# EAGLE design Voltmeter (EAGLE 9.5.2)

## Sheet 1 of 3: Fuente
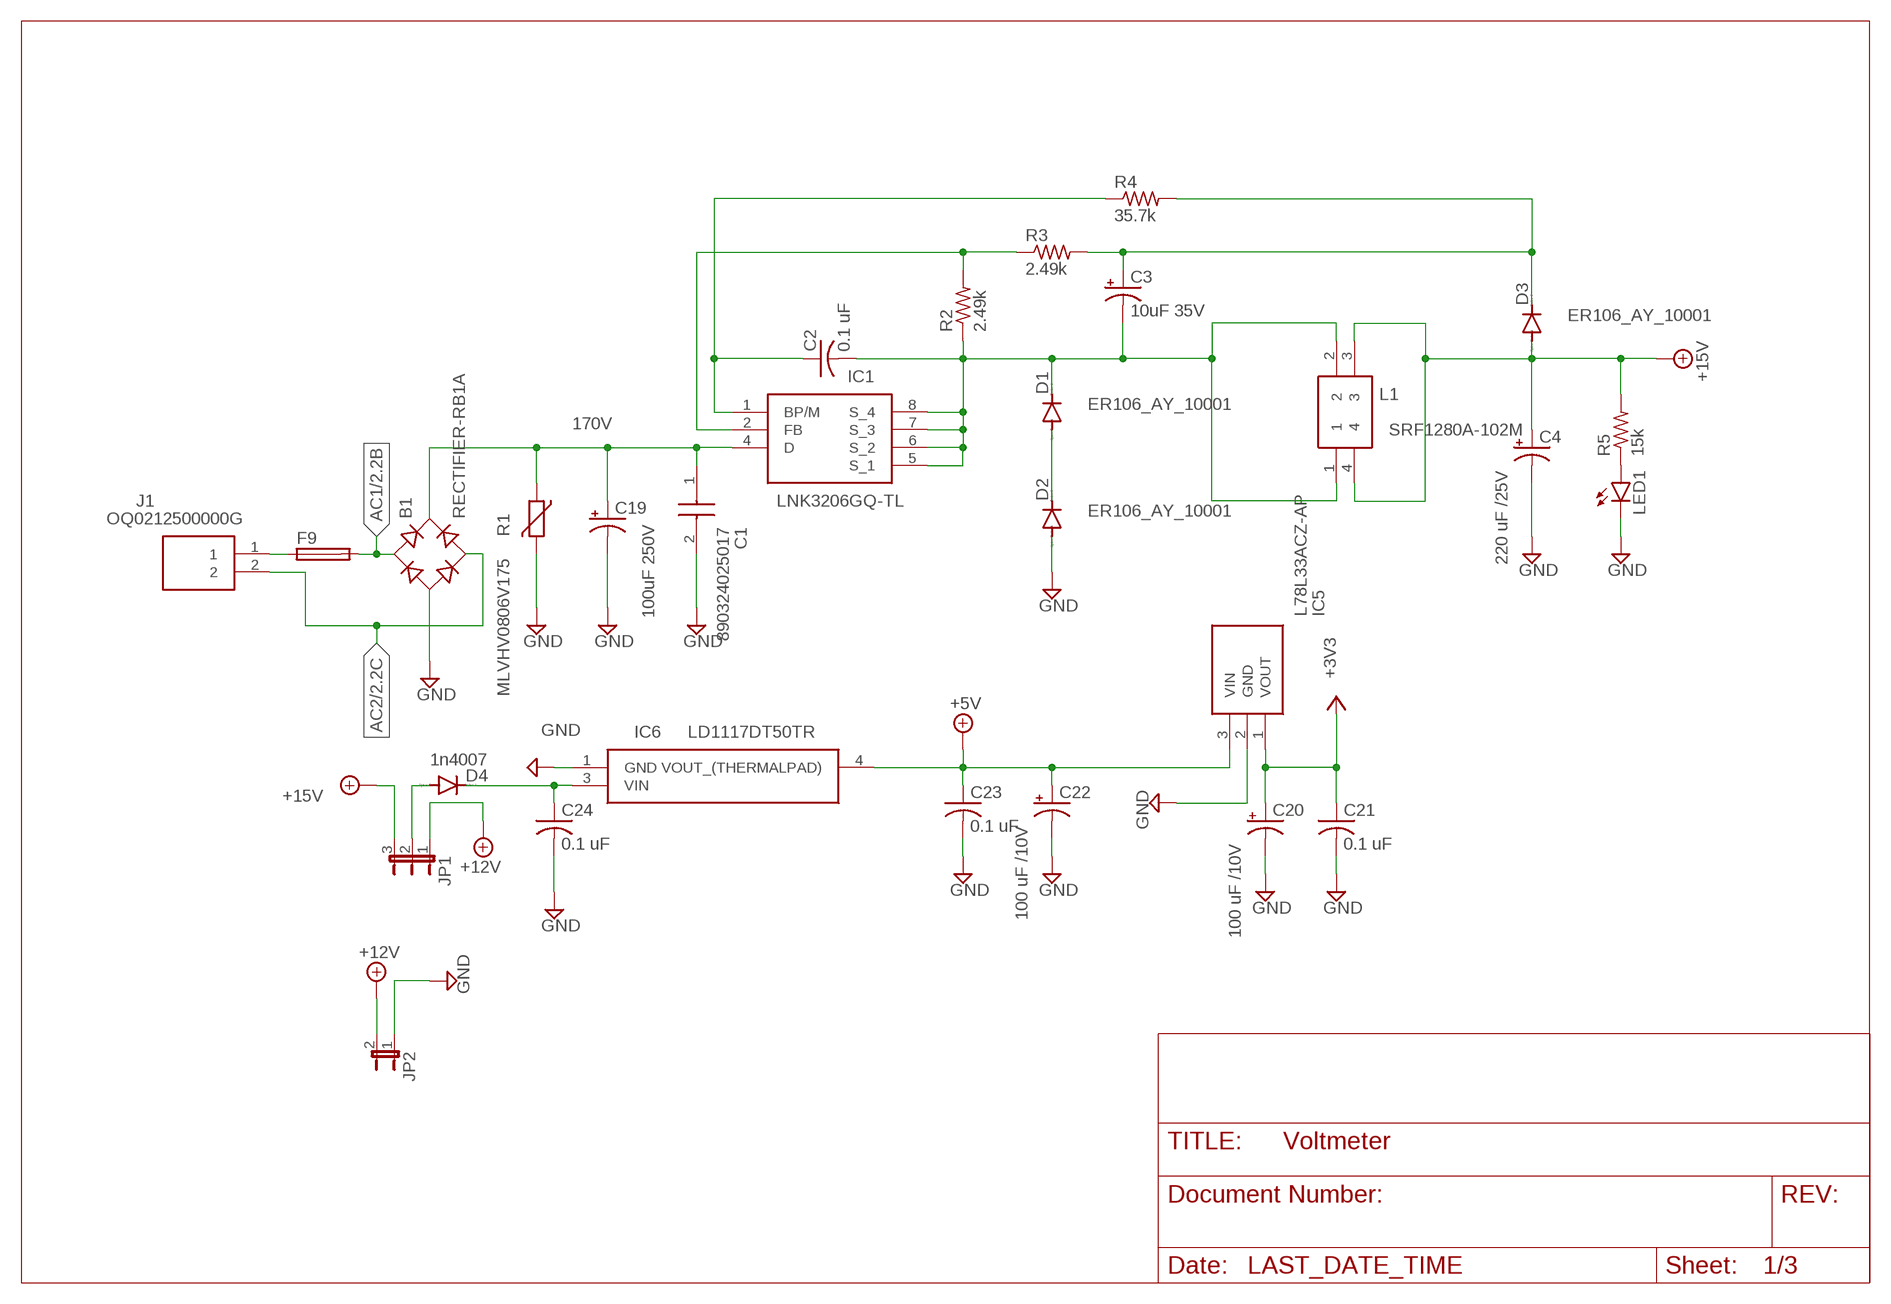
[diagram p0: schematic, sheet 1]

### Parts
B1  RECTIFIER-RB1A  [RB1A]
C1  890324025017  [890324025017]
C2  0.1 uF  C-USC0603K  [C0603K]
C3  10uF 35V  CPOL-USE2.5-6  [E2,5-6]
C4  220 uF /25V  CPOL-USE3.5-8  [E3,5-8]
C19  100uF 250V  CPOL-USE5-10.5  [E5-10,5]
C20  100 uF /10V  CPOL-USE2-5  [E2-5]
C21  0.1 uF  C-USC0603K  [C0603K]
C22  100 uF /10V  CPOL-USE2-5  [E2-5]
C23  0.1 uF  C-USC0603K  [C0603K]
C24  0.1 uF  C-USC0603K  [C0603K]
D1  ER106_AY_10001  DIODE-DO41-7.6  [DO41-7.6]
D2  ER106_AY_10001  DIODE-DO41-7.6  [DO41-7.6]
D3  ER106_AY_10001  DIODE-DO41-7.6  [DO41-7.6]
D4  1n4007  DIODE-DO41-7.6  [DO41-7.6]
F9  LITTLEFUSE  [LITTLEFUSE]
IC1  LNK3206GQ-TL  [TOP253GNTL]
IC5  L78L33ACZ-AP  [TS1107A1AP]
IC6  LD1117DT50TR  [TO228P972X240-3N]
J1  OQ0212500000G  [OQ0212500000G]
JP1  JP2E  [JP2]
JP2  JP1E  [JP1]
L1  SRF1280A-102M  [SRF1280A102M]
LED1  LEDSML0805  [SML0805]
R1  MLVHV0806V175  VARISTORCN1206  [CT/CN1206]
R2  2.49k  R-US_R0603  [R0603]
R3  2.49k  R-US_R0603  [R0603]
R4  35.7k  R-US_R0805  [R0805]
R5  15k  R-US_R0603  [R0603]

### Nets
170V: B1.+ C1.1 C19.+ IC1.4(D) R1.1
+3V3: C20.+ C21.1 IC5.1(VOUT) ; also sheet 2,3
+5V: C22.+ C23.1 IC5.3(VIN) IC6.4(VOUT_(THERMALPAD)) ; also sheet 2,3
+12V: JP1.1 JP2.2
+15V: C4.+ D3.A JP1.3 L1.3 L1.4 R5.2
AC1: B1.AC1 F9.2 ; also sheet 2
AC2: B1.AC2 J1.2 ; also sheet 2
GND: B1.- C1.2 C4.- C19.- C20.- C21.2 C22.- C23.2 C24.2 D2.A IC5.2(GND) IC6.1(GND) JP2.1 LED1.C R1.2 ; also sheet 2,3
N$1: C2.1 IC1.1(BP/M) R4.1
N$2: C2.2 C3.- D1.C IC1.5(S_1) IC1.6(S_2) IC1.7(S_3) IC1.8(S_4) L1.1 L1.2 R2.1
N$3: IC1.2(FB) R2.2 R3.1
N$4: C3.+ D3.C R3.2 R4.2
N$5: D1.A D2.C
N$7: D4.A JP1.2
N$12: LED1.A R5.1
N$14: C24.1 D4.C IC6.3(VIN)
N$41: F9.1 J1.1

## Sheet 2 of 3: Acondicionamiento
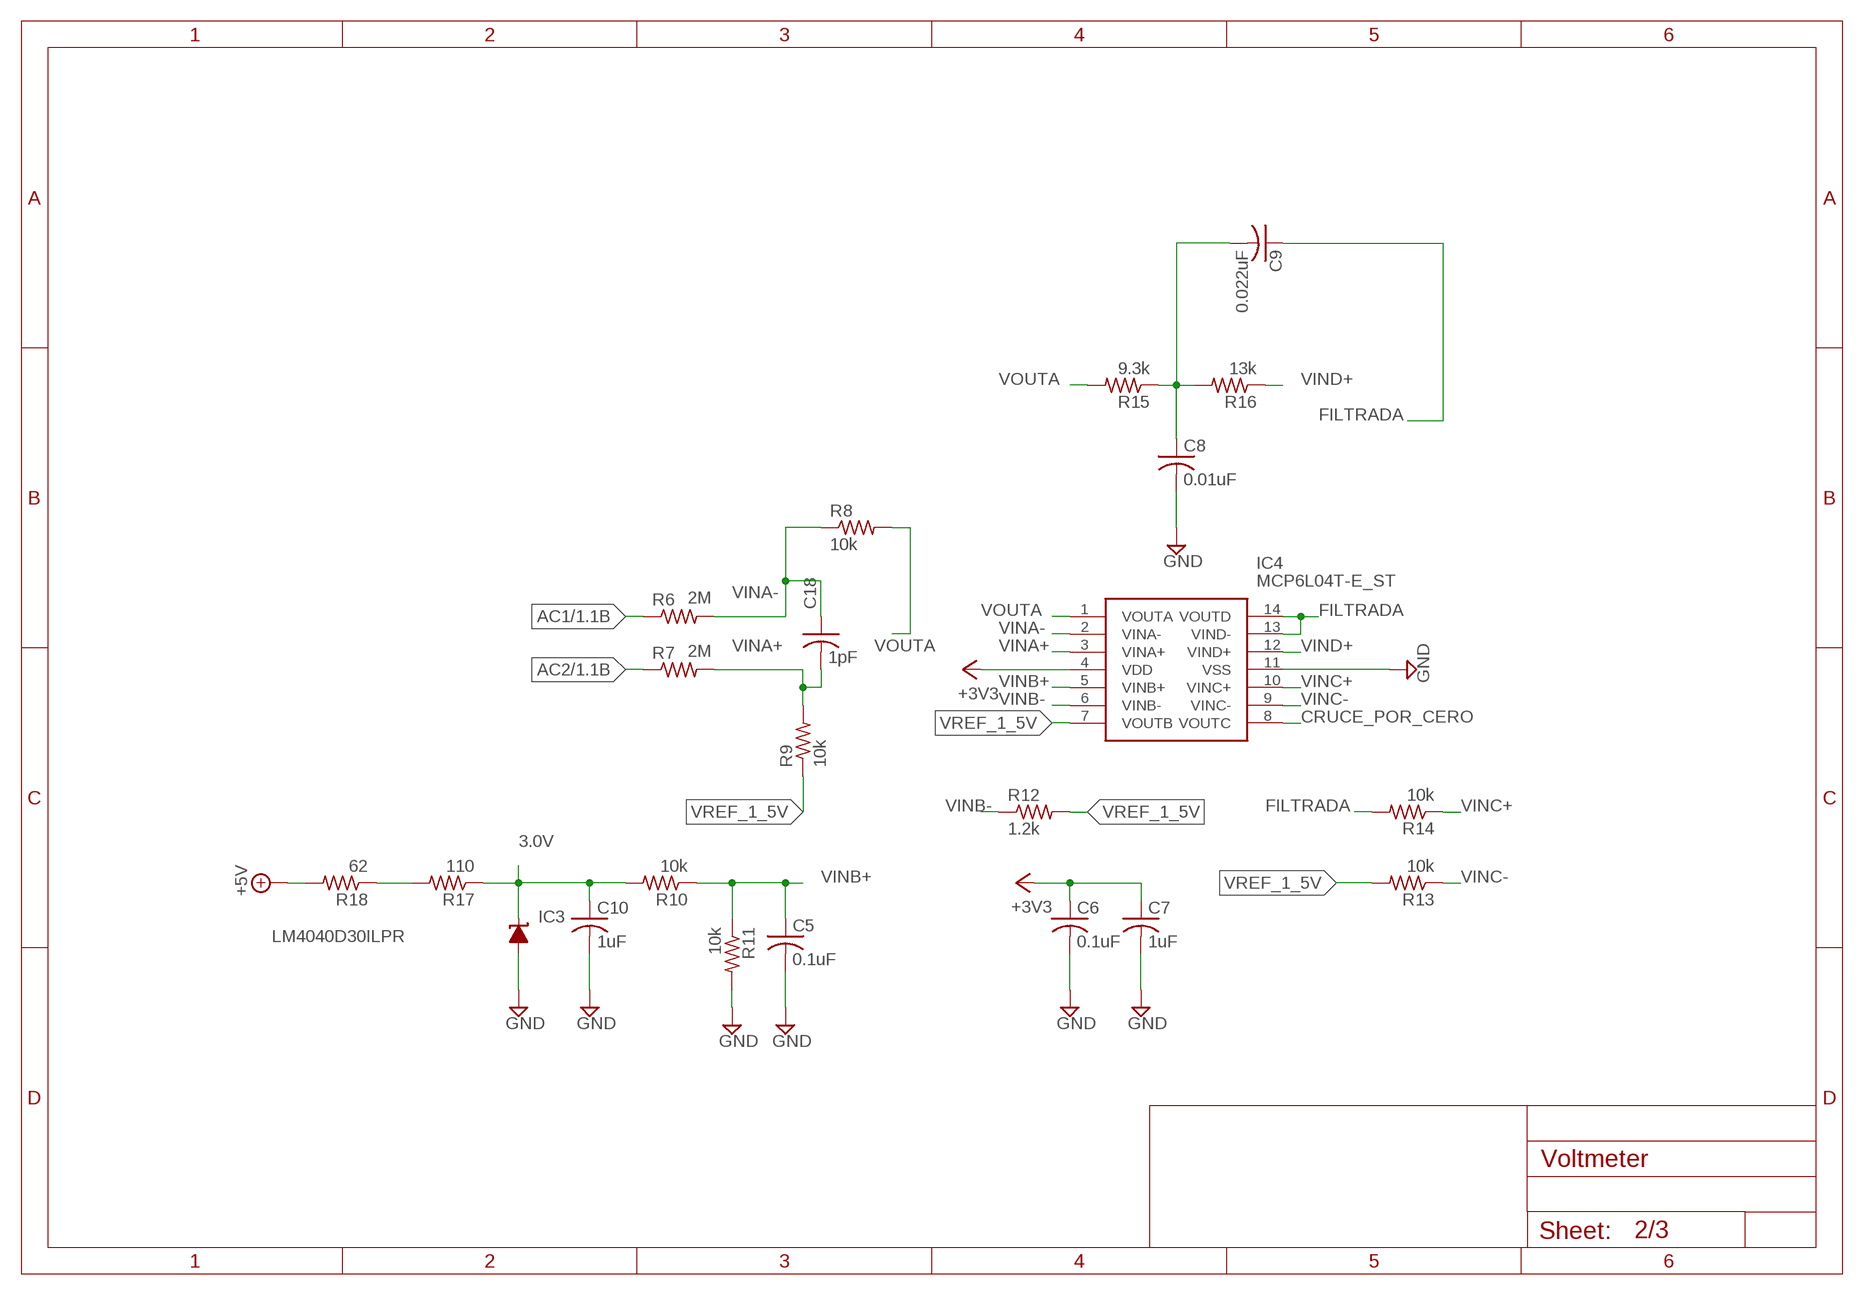
[diagram p1: schematic, sheet 2]

### Parts
C5  0.1uF  C-USC0603K  [C0603K]
C6  0.1uF  C-USC0603K  [C0603K]
C7  1uF  C-USC0603K  [C0603K]
C8  0.01uF  C-USC0603K  [C0603K]
C9  0.022uF  C-USC0603K  [C0603K]
C10  1uF  C-USC0603K  [C0603K]
C18  1pF  C-USC0603K  [C0603K]
IC3  LM4040D30ILPR  LM4041A12LP  [LP_O-PBCY-W3]
IC4  MCP6L04T-E_ST  [SOP65P640X120-14N]
R6  2M  R-US_R0603  [R0603]
R7  2M  R-US_R0603  [R0603]
R8  10k  R-US_R0603  [R0603]
R9  10k  R-US_R0603  [R0603]
R10  10k  R-US_R0603  [R0603]
R11  10k  R-US_R0603  [R0603]
R12  1.2k  R-US_R0603  [R0603]
R13  10k  R-US_R0603  [R0603]
R14  10k  R-US_R0603  [R0603]
R15  9.3k  R-US_R0603  [R0603]
R16  13k  R-US_R0603  [R0603]
R17  110  R-US_R0603  [R0603]
R18  62  R-US_R0603  [R0603]

### Nets
3.0V: C10.1 IC3.2(C) R10.2 R17.1 ; also sheet 3
+3V3: C6.1 C7.1 IC4.4(VDD) ; also sheet 1,3
+5V: R18.2 ; also sheet 1,3
AC1: R6.1 ; also sheet 1
AC2: R7.1 ; also sheet 1
CRUCE_POR_CERO: IC4.8(VOUTC) ; also sheet 3
FILTRADA: C9.1 IC4.13(VIND-) IC4.14(VOUTD) R14.2 ; also sheet 3
GND: C5.2 C6.2 C7.2 C8.2 C10.2 IC3.3(A) IC4.11(VSS) R11.2 ; also sheet 1,3
N$6: C8.1 C9.2 R15.1 R16.2
N$8: R17.2 R18.1
VINA+: C18.2 IC4.3(VINA+) R7.2 R9.2
VINA-: C18.1 IC4.2(VINA-) R6.2 R8.1
VINB+: C5.1 IC4.5(VINB+) R10.1 R11.1
VINB-: IC4.6(VINB-) R12.1
VINC+: IC4.10(VINC+) R14.1
VINC-: IC4.9(VINC-) R13.1
VIND+: IC4.12(VIND+) R16.1
VOUTA: IC4.1(VOUTA) R8.2 R15.2
VREF_1_5V: IC4.7(VOUTB) R9.1 R12.2 R13.2

## Sheet 3 of 3: CPU
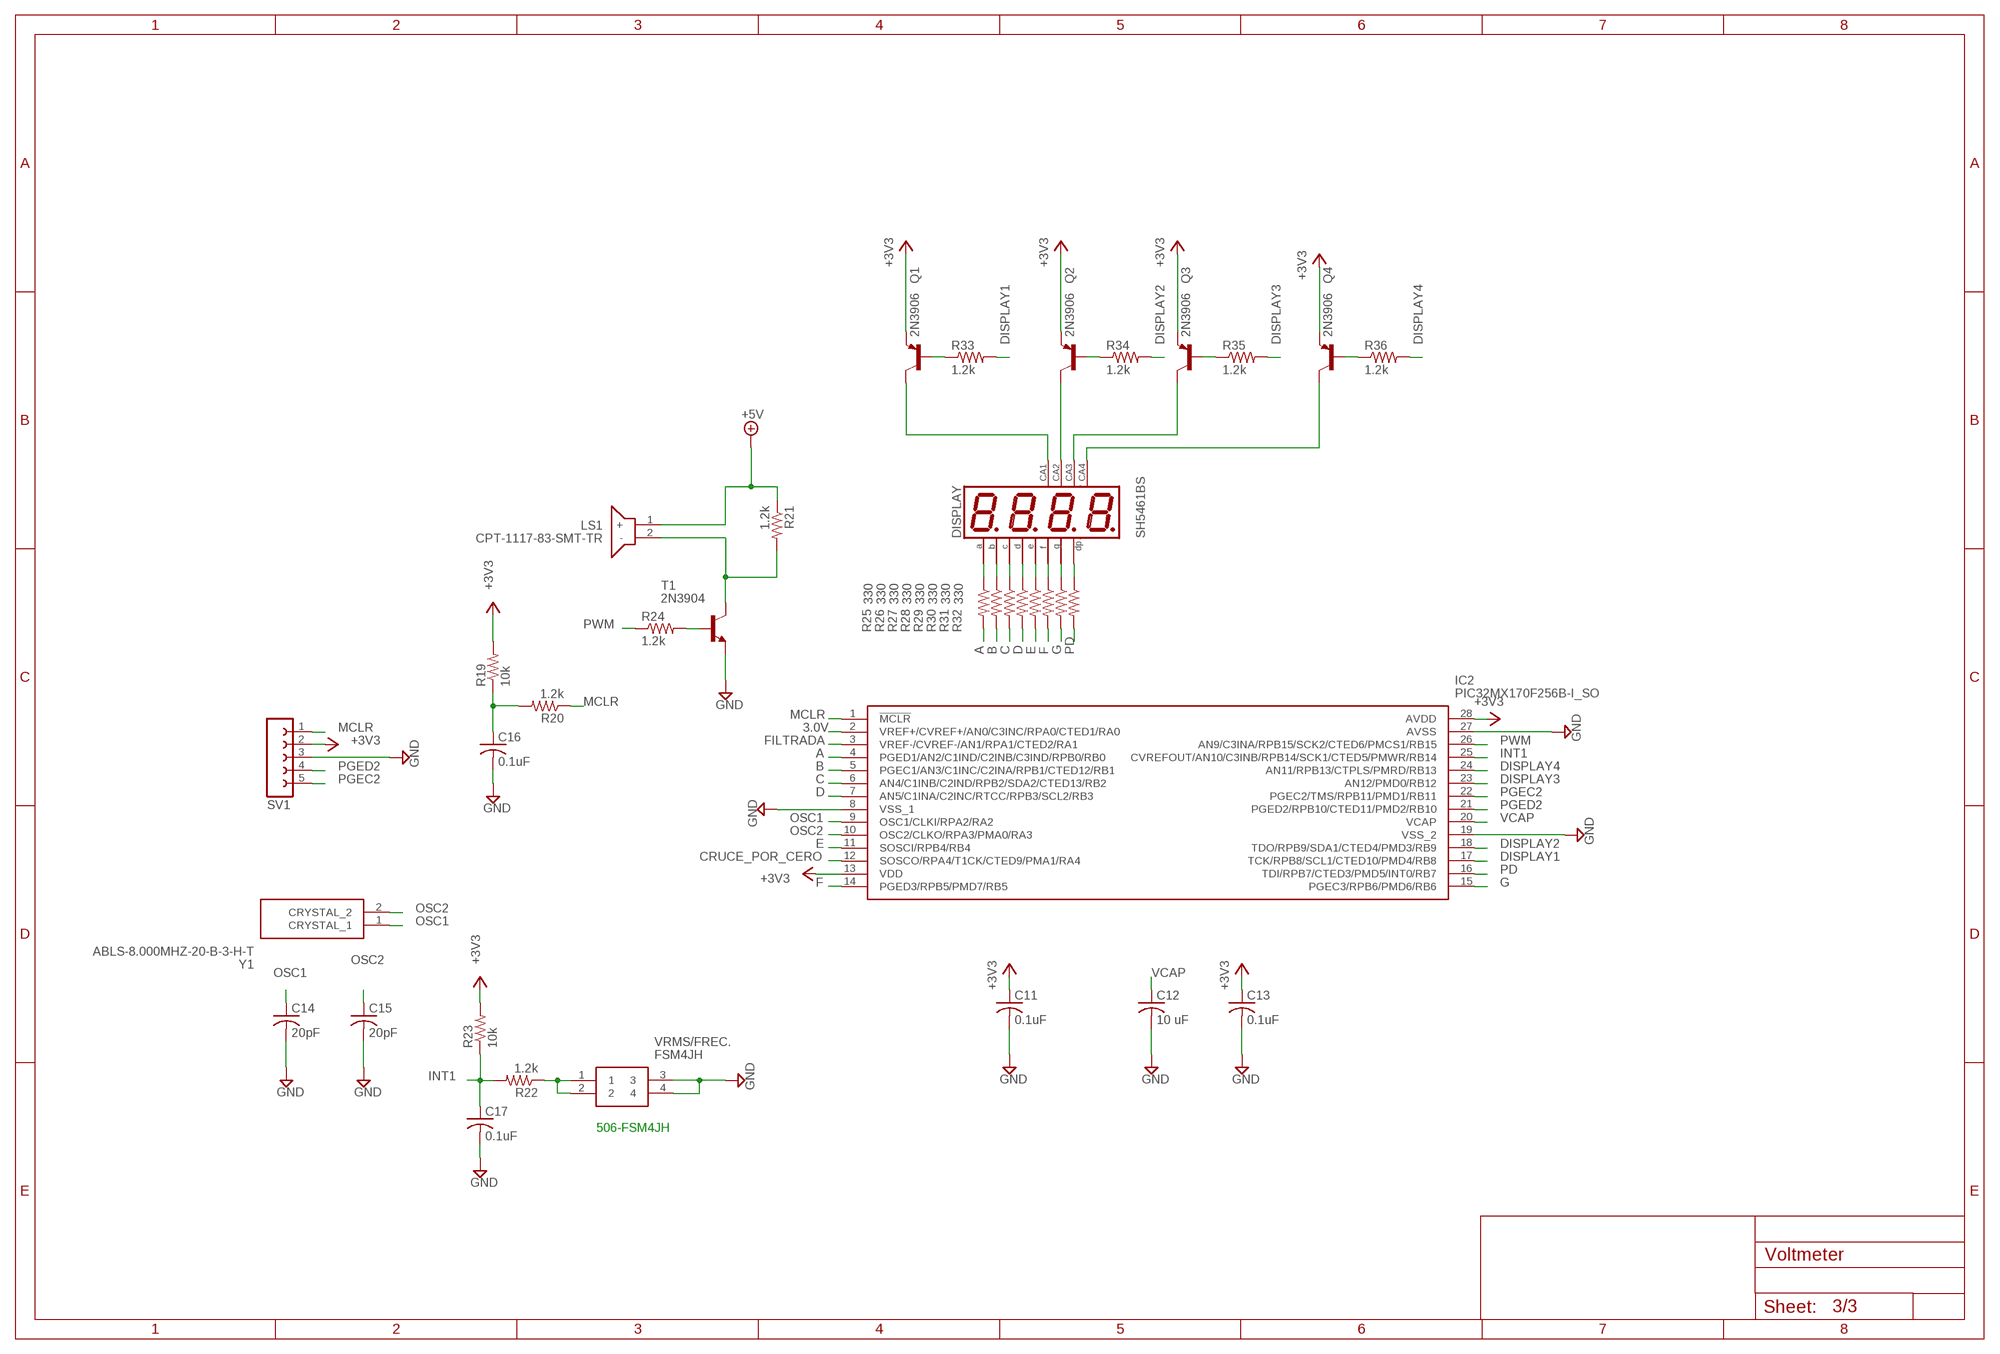
[diagram p2: schematic, sheet 3]

### Parts
C11  0.1uF  C-USC0603K  [C0603K]
C12  10 uF  C-USC1206  [C1206]
C13  0.1uF  C-USC0603K  [C0603K]
C14  20pF  C-USC0603K  [C0603K]
C15  20pF  C-USC0603K  [C0603K]
C16  0.1uF  C-USC0603K  [C0603K]
C17  0.1uF  C-USC0603K  [C0603K]
DISPLAY  SH5461BS  [BX56_FR3]
IC2  PIC32MX170F256B-I_SO  [SOIC127P1030X265-28N]
LS1  CPT-1117-83-SMT-TR  [CPT111783SMTTR]
Q1  2N3906  [TO92]
Q2  2N3906  [TO92]
Q3  2N3906  [TO92]
Q4  2N3906  [TO92]
R19  10k  R-US_R0603  [R0603]
R20  1.2k  R-US_R0603  [R0603]
R21  1.2k  R-US_R0603  [R0603]
R22  1.2k  R-US_R0603  [R0603]
R23  10k  R-US_R0603  [R0603]
R24  1.2k  R-US_R0603  [R0603]
R25  330  R-US_R0603  [R0603]
R26  330  R-US_R0603  [R0603]
R27  330  R-US_R0603  [R0603]
R28  330  R-US_R0603  [R0603]
R29  330  R-US_R0603  [R0603]
R30  330  R-US_R0603  [R0603]
R31  330  R-US_R0603  [R0603]
R32  330  R-US_R0603  [R0603]
R33  1.2k  R-US_R0603  [R0603]
R34  1.2k  R-US_R0603  [R0603]
R35  1.2k  R-US_R0603  [R0603]
R36  1.2k  R-US_R0603  [R0603]
SV1  FE05-1  [FE05-1]
T1  2N3904  [TO92]
VRMS/FREC.  FSM4JH  [FSM4JH]
Y1  ABLS-8.000MHZ-20-B-3-H-T  [ABLS8000MHZ20B3HT]

### Nets
3.0V: IC2.2(VREF+/CVREF+/AN0/C3INC/RPA0/CTED1/RA0) ; also sheet 2
+3V3: C11.1 C13.1 IC2.13(VDD) IC2.28(AVDD) Q1.3(E) Q2.3(E) Q3.3(E) Q4.3(E) R19.2 R23.2 SV1.2 ; also sheet 1,2
+5V: LS1.1(+) R21.1 ; also sheet 1,2
A: IC2.4(PGED1/AN2/C1IND/C2INB/C3IND/RPB0/RB0) R25.2
B: IC2.5(PGEC1/AN3/C1INC/C2INA/RPB1/CTED12/RB1) R26.2
C: IC2.6(AN4/C1INB/C2IND/RPB2/SDA2/CTED13/RB2) R27.2
CRUCE_POR_CERO: IC2.12(SOSCO/RPA4/T1CK/CTED9/PMA1/RA4) ; also sheet 2
D: IC2.7(AN5/C1INA/C2INC/RTCC/RPB3/SCL2/RB3) R28.2
DISPLAY1: IC2.17(TCK/RPB8/SCL1/CTED10/PMD4/RB8) R33.2
DISPLAY2: IC2.18(TDO/RPB9/SDA1/CTED4/PMD3/RB9) R34.2
DISPLAY3: IC2.23(AN12/PMD0/RB12) R35.2
DISPLAY4: IC2.24(AN11/RPB13/CTPLS/PMRD/RB13) R36.2
E: IC2.11(SOSCI/RPB4/RB4) R29.2
F: IC2.14(PGED3/RPB5/PMD7/RB5) R30.2
FILTRADA: IC2.3(VREF-/CVREF-/AN1/RPA1/CTED2/RA1) ; also sheet 2
G: IC2.15(PGEC3/RPB6/PMD6/RB6) R31.2
GND: C11.2 C12.2 C13.2 C14.2 C15.2 C16.2 C17.2 IC2.8(VSS_1) IC2.19(VSS_2) IC2.27(AVSS) SV1.3 T1.3(E) VRMS/FREC..3 VRMS/FREC..4 ; also sheet 1,2
INT1: C17.1 IC2.25(CVREFOUT/AN10/C3INB/RPB14/SCK1/CTED5/PMWR/RB14) R22.2 R23.1
MCLR: IC2.1(!MCLR) R20.1 SV1.1
N$9: C16.1 R19.1 R20.2
N$10: LS1.2(-) R21.2 T1.1(C)
N$11: R24.2 T1.2(B)
N$13: R22.1 VRMS/FREC..1 VRMS/FREC..2
N$15: DISPLAY.11(A) R25.1
N$17: DISPLAY.12(CA) Q1.1(C)
N$18: DISPLAY.7(B) R26.1
N$19: DISPLAY.4(C) R27.1
N$20: DISPLAY.2(D) R28.1
N$21: DISPLAY.1(E) R29.1
N$22: DISPLAY.10(F) R30.1
N$23: DISPLAY.5(G) R31.1
N$24: DISPLAY.3(DP) R32.1
N$25: Q1.2(B) R33.1
N$26: DISPLAY.9(CA) Q2.1(C)
N$27: DISPLAY.8(CA) Q3.1(C)
N$28: DISPLAY.6(CA) Q4.1(C)
N$29: Q2.2(B) R34.1
N$30: Q3.2(B) R35.1
N$31: Q4.2(B) R36.1
OSC1: C14.1 IC2.9(OSC1/CLKI/RPA2/RA2) Y1.1(CRYSTAL_1)
OSC2: C15.1 IC2.10(OSC2/CLKO/RPA3/PMA0/RA3) Y1.2(CRYSTAL_2)
PD: IC2.16(TDI/RPB7/CTED3/PMD5/INT0/RB7) R32.2
PGEC2: IC2.22(PGEC2/TMS/RPB11/PMD1/RB11) SV1.5
PGED2: IC2.21(PGED2/RPB10/CTED11/PMD2/RB10) SV1.4
PWM: IC2.26(AN9/C3INA/RPB15/SCK2/CTED6/PMCS1/RB15) R24.1
VCAP: C12.1 IC2.20(VCAP)

### Notes on the sheet
- 506-FSM4JH

## Library data of the parts
B1 = rectifier:RECTIFIER-: Rectifier
C1 = 890324025017:890324025017: WCAP-FTX2 Film Capacitor 100nF 275VAC Wurth Elektronik 100nF Polypropylene Capacitor (PP) 275 V ac +/-10% tolerance series WCAP-FTX2 Source: Datasheet <https://datasheet.datasheetarchive.com/originals/distributors/DKDS-9/173564.pdf>; DESCRIPTION: WCAP-FTX2 Film Capacitor 100nF 275VAC Wurth Elektronik 100nF Polypropylene Capacitor (PP) 275 V ac +/-10% tolerance series WCAP-FTX2; HEIGHT: 12.5mm; MANUFACTURER_NAME: Wurth Elektronik; MANUFACTURER_PART_NUMBER: 890324025017; MOUSER_PART_NUMBER: 710-890324025017; MOUSER_PRICE-STOCK: https://www.mouser.co.uk/ProductDetail/Wurth-Elektronik/890324025017?qs=pceeu5JH%2FH%2FMigWWfNhk4w%3D%3D
C2 C5-C18 C21 C23 C24 = rcl:C-US: CAPACITOR, American symbol; SPICEPREFIX: C
C3 C4 C19 C20 C22 = rcl:CPOL-US: POLARIZED CAPACITOR, American symbol; SPICEPREFIX: C
D1-D4 = diode:DIODE-: DIODE
DISPLAY = display-kingbright-2:SH5461BS
F9 = fuse:LITTLEFUSE: LITTLEFUSE Picofuse/slow Littlefuse; OC_FARNELL: unknown; OC_NEWARK: unknown
IC1 = LNK3206GQ-TL:LNK3206GQ-TL: AC/DC Converters 750V AEC-Q100 66kHz 360mA 100mA 3750mA Source: Datasheet <https://www.mouser.co.uk/datasheet/2/328/LinkSwitch-TN2_family_datasheet-1036065-1874711.pdf>; DESCRIPTION: AC/DC Converters 750V AEC-Q100 66kHz 360mA 100mA 3750mA; HEIGHT: 3mm; MANUFACTURER_NAME: Power Integrations; MANUFACTURER_PART_NUMBER: LNK3206GQ-TL; MOUSER_PART_NUMBER: 869-LNK3206GQ-TL; MOUSER_PRICE-STOCK: https://www.mouser.co.uk/ProductDetail/Power-Integrations/LNK3206GQ-TL?qs=sPbYRqrBIVnPQtRx0DIX%2Fg%3D%3D
IC2 = PIC32MX170F256B-I_SO:PIC32MX170F256B-I_SO: 32-bit Microcontrollers - MCU 256KB Flash 64KB RAM 40MHz, 10-bit ADC Source: Datasheet <https://4donline.ihs.com/images/VipMasterIC/IC/MCHP/MCHP-S-A0001746554/MCHP-S-A0001746554-1.pdf?hkey=6D3A4C79FDBF58556ACFDE234799DDF0>; DESCRIPTION: 32-bit Microcontrollers - MCU 256KB Flash 64KB RAM 40MHz, 10-bit ADC; HEIGHT: 2.65mm; MANUFACTURER_NAME: Microchip; MANUFACTURER_PART_NUMBER: PIC32MX170F256B-I/SO; MOUSER_PART_NUMBER: 579-32MX170F256BI/SO; MOUSER_PRICE-STOCK: https://www.mouser.co.uk/ProductDetail/Microchip-Technology/PIC32MX170F256B-I-SO?qs=PQDAUpz3sUN3OyQZwOVAtg%3D%3D
IC3 = texas:LM4041: PRECISION MICROPOWER SHUNT VOLTAGE REFERENCE Source: http://focus.ti.com/lit/ds/slcs146e/slcs146e.pdf; OC_FARNELL: 9486119; OC_NEWARK: unknown
IC4 = MCP6L04T-E_ST:MCP6L04T-E_ST: Microchip MCP6L04T-E/ST, Quad Op Amp, 1MHz Rail-Rail, 1.8 6 V, 14-Pin TSSOP Source: Datasheet <https://componentsearchengine.com/Datasheets/1/MCP6L04T-E_ST.pdf>; DESCRIPTION: Microchip MCP6L04T-E/ST, Quad Op Amp, 1MHz Rail-Rail, 1.8 6 V, 14-Pin TSSOP; HEIGHT: 1.2mm; MANUFACTURER_NAME: Microchip; MANUFACTURER_PART_NUMBER: MCP6L04T-E/ST; MOUSER_PART_NUMBER: 579-MCP6L04T-E/ST; MOUSER_PRICE-STOCK: https://www.mouser.com/Search/Refine.aspx?Keyword=579-MCP6L04T-E%2FST
IC5 = L78L33ACZ-AP:L78L33ACZ-AP: Linear Voltage Regulators 3.3V 0.1A Positive Source: Datasheet <https://www.st.com/resource/en/datasheet/l78l.pdf>; DESCRIPTION: Linear Voltage Regulators 3.3V 0.1A Positive; HEIGHT: 4.95mm; MANUFACTURER_NAME: STMicroelectronics; MANUFACTURER_PART_NUMBER: L78L33ACZ-AP; MOUSER_PART_NUMBER: 511-L78L33ACZ-AP; MOUSER_PRICE-STOCK: https://www.mouser.co.uk/ProductDetail/STMicroelectronics/L78L33ACZ-AP?qs=1jluZrBjIwa4HsgH9z63Bg%3D%3D
IC6 = LD1117DT50TR:LD1117DT50TR: LDO Regulator 5V 1.3A DPAK STMicroelectronics LD1117DT50TR, LDO Voltage Regulator, 1.3A, 5 V +/-1%, 3-Pin DPAK Source: Datasheet <http://www.st.com/web/en/resource/technical/document/datasheet/CD00000544.pdf>; DESCRIPTION: LDO Regulator 5V 1.3A DPAK STMicroelectronics LD1117DT50TR, LDO Voltage Regulator, 1.3A, 5 V +/-1%, 3-Pin DPAK; HEIGHT: 2.4mm; MANUFACTURER_NAME: STMicroelectronics; MANUFACTURER_PART_NUMBER: LD1117DT50TR; MOUSER_PART_NUMBER: 511-LD1117DT50-TR; MOUSER_PRICE-STOCK: https://www.mouser.co.uk/ProductDetail/STMicroelectronics/LD1117DT50TR?qs=ib3vAMMXL5HQnys7jeJYRw%3D%3D
J1 = OQ0212500000G:OQ0212500000G: Pluggable Terminal Blocks 2P 3.50MM HDR STR PLUGGABLE TERM BLK Source: Datasheet <https://datasheet.datasheetarchive.com/originals/distributors/DKDS-9/178262.pdf>; DESCRIPTION: Pluggable Terminal Blocks 2P 3.50MM HDR STR PLUGGABLE TERM BLK; HEIGHT: 9.2mm; MANUFACTURER_NAME: Amphenol; MANUFACTURER_PART_NUMBER: OQ0212500000G; MOUSER_PART_NUMBER: 649-220107-C021A01LF; MOUSER_PRICE-STOCK: https://www.mouser.co.uk/ProductDetail/Amphenol-Anytek/OQ0212500000G?qs=Mv7BduZupUhn3%2FKe8nJdbQ%3D%3D
JP1 = jumper:JP2E: JUMPER
JP2 = jumper:JP1E: JUMPER
L1 = SRF1280A-102M:SRF1280A-102M: Coupled Inductors 1000uH 20% SMD 1280 AEC-Q200 Source: Datasheet <https://www.bourns.com/docs/product-datasheets/SRF1280A.pdf>; DESCRIPTION: Coupled Inductors 1000uH 20% SMD 1280 AEC-Q200; HEIGHT: 8mm; MANUFACTURER_NAME: Bourns; MANUFACTURER_PART_NUMBER: SRF1280A-102M; MOUSER_PART_NUMBER: 652-SRF1280A-102M; MOUSER_PRICE-STOCK: https://www.mouser.co.uk/ProductDetail/Bourns/SRF1280A-102M?qs=xGZga0pI15O%2Fmaw03BksRw%3D%3D
LED1 = led:LED: LED OSRAM: - CHIPLED LG R971, LG N971, LY N971, LG Q971, LY Q971, LO R971, LY R971 LH N974, LH R974 LS Q976, LO Q976, LY Q976 LO Q996 - Hyper CHIPLED LW Q18S LB Q993, LB Q99A, LB R99A - SideLED LS A670, LO A670, LY A670, LG A670, LP A670 LB A673, LV A673, LT A673, LW A673 LH A674 LY A675 LS A676, LA A676, LO A676, LY A676, LW A676 LS A679, LY A679, LG A679 - Hyper Micro SIDELED® LS Y876, LA Y876, LO Y876, LY Y876 LT Y87S - SmartLED LW L88C, LW L88S LB L89C, LB L89S, LG L890 LS L89K, LO L89K, LY L89K LS L896, LA L896, LO L896, LY L896 - TOPLED LS T670, LO T670, LY T670, LG T670, LP T670 LSG T670, LSP T670, LSY T670, LOP T670, LYG T670 LG T671, LOG T671, LSG T671 LB T673, LV T673, LT T673, LW T673 LH T674 LS T676, LA T676, LO T676, LY T676, LB T676, LH T676, LSB T676, LW T676 LB T67C, LV T67C, LT T67C, LS T67K, LO T67K, LY T67K, LW E67C LS E67B, LA E67B, LO E67B, LY E67B, LB E67C, LV E67C, LT E67C LW T67C LS T679, LY T679, LG T679 LS T770, LO T770, LY T770, LG T770, LP T770 LB T773, LV T773, LT T773, LW T773 LH T774 LS E675, LA E675, LY E675, LS T675 LS T776, LA T776, LO T776, LY T776, LB T776 LHGB T686 LT T68C, LB T68C - Hyper Mini TOPLED® LB M676 - Mini TOPLED Santana® LG M470 LS M47K, LO M47K, LY M47K Source: http://www.osram.convergy.de LUXEON: - LUMILED® LXK2-PW12-R00, LXK2-PW12-S00, LXK2-PW14-U00, LXK2-PW14-V00 LXK2-PM12-R00, LXK2-PM12-S00, LXK2-PM14-U00 LXK2-PE12-Q00, LXK2-PE12-R00, LXK2-PE12-S00, LXK2-PE14-T00, LXK2-PE14-U00 LXK2-PB12-K00, LXK2-PB12-L00, LXK2-PB12-M00, LXK2-PB14-N00, LXK2-PB14-P00, LXK2-PB14-Q00 LXK2-PR12-L00, LXK2-PR12-M00, LXK2-PR14-Q00, LXK2-PR14-R00 LXK2-PD12-Q00, LXK2-PD12-R00, LXK2-PD12-S00 LXK2-PH12-R00, LXK2-PH12-S00 LXK2-PL12-P00, LXK2-PL12-Q00, LXK2-PL12-R00 Source: www.luxeon.com KINGBRIGHT: KA-3528ASYC Source: www.kingbright.com
LS1 = CPT-1117-83-SMT-TR:CPT-1117-83-SMT-TR: Piezo Buzzers & Audio Indicators buzzer, 11 mm x 9mm x 1.7 mm deep, P, 5 V, 83 dB, Surface Mount (SMT), Audio Transducer Source: Datasheet <https://www.cuidevices.com/product/resource/cpt-1117-83-smt-tr.pdf>; DESCRIPTION: Piezo Buzzers & Audio Indicators buzzer, 11 mm x 9mm x 1.7 mm deep, P, 5 V, 83 dB, Surface Mount (SMT), Audio Transducer; HEIGHT: 1.7mm; MANUFACTURER_NAME: CUI Devices; MANUFACTURER_PART_NUMBER: CPT-1117-83-SMT-TR; MOUSER_PART_NUMBER: 490-CPT-1117-83SMTTR; MOUSER_PRICE-STOCK: https://www.mouser.co.uk/ProductDetail/CUI-Devices/CPT-1117-83-SMT-TR?qs=P1JMDcb91o4XIEWq5BWiAg%3D%3D
Q1-Q4 = transistor-pnp:2N3906: PNP Transistor
R1 = varistor:VARISTOR: VARISTOR
R2-R36 = rcl:R-US_: RESISTOR, American symbol; SPICEPREFIX: R
SV1 = con-lsta:FE05-1: FEMALE HEADER; OC_FARNELL: unknown; OC_NEWARK: unknown
T1 = transistor:2N3904: NPN TRANSISTOR
VRMS/FREC. = FSM4JH:FSM4JH: 6x6mm tactile switch,5mm H 1.6N Black Button Tactile Switch, SPST-NO 50 mA@ 24 V dc 1.4mm Source: Datasheet <https://componentsearchengine.com/Datasheets/1/FSM4JH.pdf>; DESCRIPTION: 6x6mm tactile switch,5mm H 1.6N Black Button Tactile Switch, SPST-NO 50 mA@ 24 V dc 1.4mm; HEIGHT: mm; MANUFACTURER_NAME: TE Connectivity; MANUFACTURER_PART_NUMBER: FSM4JH; MOUSER_PART_NUMBER: 506-FSM4JH
Y1 = ABLS-8.000MHz-20-B-3-H-T:ABLS-8.000MHZ-20-B-3-H-T: CRYSTAL 8.0000MHZ 20PF SMD Source: Datasheet <https://componentsearchengine.com/Datasheets/2/ABLS-8.000MHZ-B4-T.pdf>; DESCRIPTION: CRYSTAL 8.0000MHZ 20PF SMD; HEIGHT: 4.2mm; MANUFACTURER_NAME: ABRACON; MANUFACTURER_PART_NUMBER: ABLS-8.000MHz-20-B-3-H-T; MOUSER_PART_NUMBER: 815-LS8000MHZ20B3HT; MOUSER_PRICE-STOCK: https://www.mouser.co.uk/ProductDetail/ABRACON/ABLS-8000MHz-20-B-3-H-T?qs=vLWxofP3U2w2LK%252Bt982rbw%3D%3D

## Board
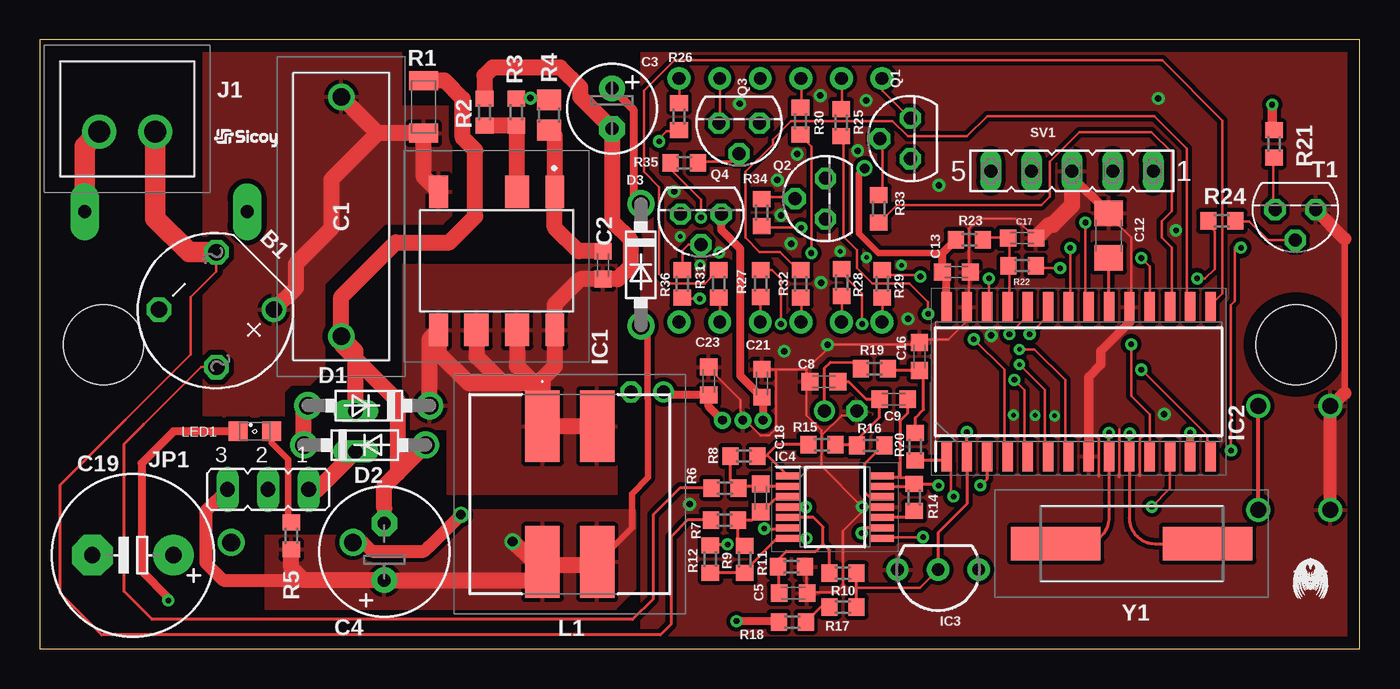
[diagram p3: board, top side]
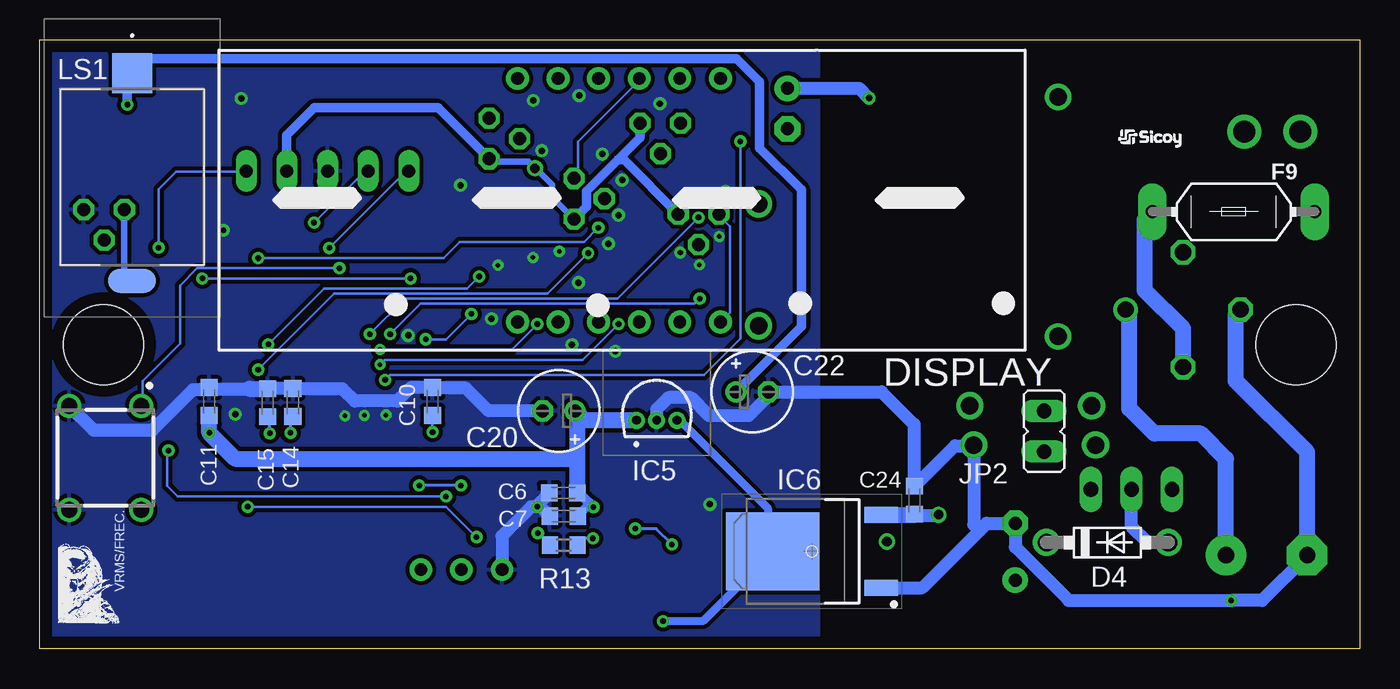
[diagram p4: board, bottom side, seen from below]

Size 82.55 x 38.1 mm. Coordinates in mm from the lower left corner, seen from the top.
Outline: 0,0 82.55,0 82.55,38.1 0,38.1 0,0
Copper layers (1*16): Top 0.035mm / dielectric 1.5mm / Bottom 0.035mm
Design rules "default *": minimum track width 6mil, minimum drill 0.35mm, track to track 6mil, track to pad 6mil, pad to pad 6mil, via to via 6mil, smd to smd 6mil, copper to edge 30mil, drill to drill 6mil, minimum pad ring 10mil, minimum via ring 8mil, stop-mask expansion 4mil, vias tented up to drill 15mil, thermal gap 10mil
Holes 5 mm at 3.98,19.04 78.57,19.04

### Footprints (pad centres in the part's own frame; a part is rotated, then mirrored left to right if it is on the bottom)
RB1A = drill 1.016: + -2.54,2.54 | drill 1.016 octagon: - 2.54,-2.54; AC1 2.54,2.54; AC2 -2.54,-2.54
890324025017 = drill 1.1 pad 1.65: 1 0,0; 2 15,0
C0603K = smd 1.05 x 1.08: 1 -0.875,0; 2 0.875,0
E2,5-6 = drill 0.813 pad 1.6: + -1.27,0 | drill 0.813 pad 1.6 octagon: - 1.27,0
E3,5-8 = drill 0.813 pad 1.6: + -1.778,0 | drill 0.813 pad 1.6 octagon: - 1.778,0
C1206 = smd 1.6 x 1.8: 1 -1.4,0; 2 1.4,0
E5-10,5 = drill 1.016 pad 2.54: + -2.54,0 | drill 1.016 pad 2.54 octagon: - 2.54,0
E2-5 = drill 0.813 pad 1.27: + -1.016,0 | drill 0.813 pad 1.27 octagon: - 1.016,0
DO41-7.6 = drill 1.1 pad 1.7: A 3.81,0; C -3.81,0
BX56_FR3 = drill 0.8 pad 1.422: 1 0,-7.62; 2 2.54,-7.62; 3 5.08,-7.62; 4 7.62,-7.62; 5 10.16,-7.62; 6 12.7,-7.62; 7 12.7,7.62; 8 10.16,7.62; 9 7.62,7.62; 10 5.08,7.62; 11 2.54,7.62; 12 0,7.62
LITTLEFUSE = drill 0.813 pad 1.778 long: 1 -5.08,0; 2 5.08,0
TOP253GNTL = smd 1.168 x 2.032: 1 -3.632,-3.527; 4 3.632,-3.527; 5 3.632,5.109; 8 -3.632,5.109 | smd 1.524 x 2.032: 2 -1.27,-3.527; 6 1.27,5.109; 7 -1.27,5.109
SOIC127P1030X265-28N = smd 1.85 x 0.65: 1 -4.675,8.255; 2 -4.675,6.985; 3 -4.675,5.715; 4 -4.675,4.445; 5 -4.675,3.175; 6 -4.675,1.905; 7 -4.675,0.635; 8 -4.675,-0.635; 9 -4.675,-1.905; 10 -4.675,-3.175; 11 -4.675,-4.445; 12 -4.675,-5.715; 13 -4.675,-6.985; 14 -4.675,-8.255; 15 4.675,-8.255; 16 4.675,-6.985; 17 4.675,-5.715; 18 4.675,-4.445; 19 4.675,-3.175; 20 4.675,-1.905; 21 4.675,-0.635; 22 4.675,0.635; 23 4.675,1.905; 24 4.675,3.175; 25 4.675,4.445; 26 4.675,5.715; 27 4.675,6.985; 28 4.675,8.255
LP_O-PBCY-W3 = drill 0.8 pad 1.4: 1 -2.54,0; 2 0,0; 3 2.54,0
SOP65P640X120-14N = smd 1.475 x 0.45: 1 -2.938,1.95; 2 -2.938,1.3; 3 -2.938,0.65; 4 -2.938,0; 5 -2.938,-0.65; 6 -2.938,-1.3; 7 -2.938,-1.95; 8 2.938,-1.95; 9 2.938,-1.3; 10 2.938,-0.65; 11 2.938,0; 12 2.938,0.65; 13 2.938,1.3; 14 2.938,1.95
TS1107A1AP = drill 0.55 pad 1.016: 1 0,0; 2 1.27,0; 3 2.54,0
TO228P972X240-3N = smd 2.1 x 1: 1 -4.35,2.28; 3 -4.35,-2.28 | smd 5.85 x 4.9: 4 2.45,0
OQ0212500000G = drill 1.4 pad 2.1: 1 0,0; 2 3.5,0
JP2 = drill 0.914 long: 1 -2.54,0; 2 0,0; 3 2.54,0
JP1 = drill 0.914 long: 1 0,-1.27; 2 0,1.27
SRF1280A102M = smd 2.15 x 4.5: 1 -1.715,4.25; 2 1.715,4.25; 3 1.715,-4.25; 4 -1.715,-4.25
SML0805 = smd 1.2 x 1.2: A 1.05,0; C -1.05,0
CPT111783SMTTR = smd 2.5 x 2.5: 1 0,0 | smd 3 x 1.5: 2 0,-13
TO92 = drill 0.813 octagon: 1 1.27,0; 2 0,1.905; 3 -1.27,0
CT/CN1206 = smd 1.2 x 1.8: 1 -1.65,0; 2 1.65,0
R0603 = smd 1 x 1.1: 1 -0.85,0; 2 0.85,0
R0805 = smd 1.3 x 1.5: 1 -0.95,0; 2 0.95,0
FE05-1 = drill 0.813 long: 1 -5.08,0; 2 -2.54,0; 3 0,0; 4 2.54,0; 5 5.08,0
FSM4JH = drill 1 pad 1.5: 1 -3.25,2.25; 2 3.25,2.25; 3 -3.25,-2.25; 4 3.25,-2.25
ABLS8000MHZ20B3HT = smd 5.6 x 2.1: 1 -4.75,0; 2 4.75,0

### Placement (x,y rotation side)
B1  11.04,21.22 225 top
C1  18.85,34.54 270 top
C2  35.23,24 270 top
C3  35.79,33.81 270 top
C4  21.54,6.07 90 top
C5  47.12,3.48 0 top
C6  49.81,9.75 180 bottom
C7  49.78,8.31 180 bottom
C8  49.05,16.71 180 top
C9  53.4,15.62 180 top
C10  57.99,15.47 90 bottom
C11  71.96,15.47 90 bottom
C12  66.85,25.86 90 top
C13  57.33,23.57 0 top
C14  66.73,15.42 90 bottom
C15  68.3,15.39 90 bottom
C16  55.02,18.29 90 top
C17  61.44,25.7 0 top
C18  45.09,9.45 270 top
C19  5.82,5.85 180 top
C20  50.09,14.88 180 bottom
C21  45.16,16.61 90 top
C22  38,16.08 0 bottom
C23  41.83,16.76 90 top
C24  27.84,9.3 90 bottom
D1  20.57,15.21 180 top
D2  20.32,12.75 0 top
D3  37.59,24.03 270 top
D4  15.77,6.65 0 bottom
DISPLAY  52.68,28.07 0 bottom
F9  7.87,27.34 180 bottom
IC1  28.57,25.07 180 top
IC2  64.97,16.71 90 top
IC3  56.18,4.95 180 top
IC4  49.73,8.86 0 top
IC5  45.24,14.3 0 bottom
IC6  34.26,6.1 180 bottom
J1  3.71,32.36 0 top
JP1  14.27,9.97 180 top
JP2  19.74,13.61 180 bottom
L1  33.15,9.68 0 top
LED1  13.45,13.61 0 top
LS1  76.78,36.02 0 bottom
Q1  54.46,31.93 90 top
Q2  49.15,28.17 90 top
Q3  43.74,32.89 180 top
Q4  41.35,27.2 180 top
R1  24,33.91 90 top
R2  27.81,33.58 270 top
R3  29.79,33.58 90 top
R4  31.85,33.4 90 top
R5  15.72,7.06 270 top
R6  42.85,10.06 0 top
R7  42.82,8.05 0 top
R8  44.04,12.06 0 top
R9  44.09,5.59 90 top
R10  50.24,4.72 0 top
R11  47.02,5.13 0 top
R12  41.94,5.61 270 top
R13  49.78,6.48 0 bottom
R14  54.69,9.47 90 top
R15  48.92,12.78 180 top
R16  51.97,12.73 180 top
R17  50.24,2.62 180 top
R18  47.07,1.68 180 top
R19  52.2,17.53 180 top
R20  54.76,12.65 90 top
R21  77.19,31.6 270 top
R22  61.44,23.98 180 top
R23  58.14,25.6 180 top
R24  73.94,26.77 0 top
R25  50.11,32.92 270 top
R26  39.98,33.3 270 top
R27  45.09,22.86 90 top
R28  50.16,22.91 90 top
R29  52.68,22.83 90 top
R30  47.57,33.02 270 top
R31  42.47,22.83 90 top
R32  47.6,22.83 90 top
R33  52.48,27.53 270 top
R34  45.16,27.3 270 top
R35  40.31,30.4 180 top
R36  40.18,22.83 270 top
SV1  64.57,29.9 180 top
T1  78.54,27.48 180 top
VRMS/FREC.  78.46,11.95 270 bottom
Y1  68.3,6.58 0 top

### Tracks (layer width: path | path; a pad name or v marks a point on that pad's centre or on a via)
3.0V  (via drill 0.35)
  Top 0.152: IC3.2 55.04,3.81 51.09,3.81
  Top 0.203: R17.1 51.09,3.81 R10.2 | IC3.2 56.19,7.26 57.99,9.07 IC2.2 v57.99,13.56
  Bottom 0.203: v57.99,13.56 C10.1
170V
  Top 1.016: IC1.4 24,29.54 R1.1 21.13,32.26 | 21.13,32.26 C1.1 | 21.13,32.26 18.22,29.34 18.22,26.3 16,24.07 16,22.59 B1.+
  Bottom 1.016: C19.+ 8.36,11.88 9.94,13.46 12.83,13.46 14.4,15.04 14.4,21 B1.+
  pour Top (isolate 0.33): 11.4,14.63 10.24,14.63 10.24,32.46 10.24,38 21.64,38 22.61,38 22.61,33.99 22.61,33.91 24.03,33.91 25.7,33.91 25.7,27.51 25.7,27.1 25.2,26.59 21.59,26.59 17.81,22.81 17.78,22.78 17.78,17.4 16.92,16.54 15.75,16.54 15.24,16.03 15.24,14.55 15.21,14.53 11.46,14.53 11.46,14.63 11.43,14.63
+3V3  (via drill 0.35, 0.6)
  Top 0.152: 56.52,23.81 C13.1 56.2,23.81 | 45.09,15.88 C21.1 | 49.44,17.92 50.95,17.92 51.2,17.67
  Top 0.203: 51.2,17.67 R19.2 | 49.44,17.92 49.05,17.53 49.05,14.91 C20.+
  Top 0.406: IC4.4 v47.93,8.87 | 56.45,24.77 52.45,24.77 51.23,25.98 51.23,29.74 51.56,30.07 v51.59,30.07
  Top 0.508: IC5.1 45.24,15.66 C21.1 43.81,17.08 43.81,25.02 42.62,26.21 Q4.3 | IC2.13 v71.96,13.51 | IC2.28 56.72,23.31 C13.1 56.45,24.77 R23.2
  Bottom 0.152: 45.09,32.7 Q3.3 | 66.99,30.16 SV1.2 | 49.21,26.99 Q2.3 | Q1.3 54.28,30.48
  Bottom 0.203: 48.93,9.56 C6.1
  Bottom 0.406: 54.28,30.48 51.99,30.48 v51.59,30.07 51.56,30.07 50.52,29.03 50.52,28.27 Q2.3
  Bottom 0.61: 48.93,9.56 48.63,9.56 v47.93,8.87 48.35,8.87 C7.1 | Q2.3 48.36,27.69 48.36,28.63 46.4,30.6 | Q3.3 45.01,31.98 46.4,30.6 | Q4.3 46.02,30.6 46.4,30.6 | Q1.3 57.66,33.86 65.41,33.86 67.11,32.16 SV1.2
  Bottom 1.016: C6.1 48.93,11.94 | 48.93,11.94 48.93,14.75 | 48.93,14.75 C20.+ | IC5.1 48.49,14.3 48.93,14.75 | 48.93,11.94 48.98,11.89 70.33,11.89 v71.96,13.51 C11.1
+5V  (via drill 0.35)
  Top 0.152: 41.91,15.88 C23.1 41.59,15.88 | R18.2 46.22,1.71 46.06,1.91
  Top 0.508: 46.22,1.71 43.59,1.71 v43.57,1.73 | IC5.3 41.83,15.16 C23.1 39.2,15.89 C22.+
  Top 0.61: v77.09,34.05 77.09,32.55 R21.1
  Bottom 0.152: 42.55,14.29 IC5.3 | 36.83,6.03 37.01,5.85 39.05,3.81 IC6.4 36.83,6.03
  Bottom 0.508: IC6.4 41.08,1.73 v43.57,1.73 | IC5.3 42.52,14.3 37.01,8.79 37.01,5.85
  Bottom 0.61: C22.+ 34.92,20.17 34.92,28.73 37.54,31.34 37.54,35.48 38.99,36.93 75.87,36.93 LS1.1 77.09,35.72 v77.09,34.05
+12V
  Top 1.016: JP2.2 17.37,9.97 JP1.1
+15V  (via drill 0.6)
  Top 0.152: 35.24,6.03 35.24,5.71 35,5.53 L1.3
  Top 0.406: D3.A 38,19.81 38,15.66 38.05,15.61 38.05,10.72 37.03,9.7 37.03,7.56 35,5.53
  Top 0.813: JP1.3 10.38,8.62 10.38,5.38 11.47,4.29 16.48,4.29
  Top 1.016: R5.2 15.72,5.05 16.48,4.29 C4.+ 31.6,4.29 31.65,4.34 31.65,5.21 | 31.65,5.21 L1.4 30.89,5.43 29.62,6.71 v29.57,6.71 | L1.3 34.65,5.21 31.65,5.21
  Bottom 0.152: 21.59,4.13 C4.+
  pour Top (isolate 0.254): 33.15,8.66 22.63,8.66 22.63,6.07 20.32,6.07 20.32,6.48 20.32,7.06 15.72,7.06 14.12,7.06 14.12,4.47 14.12,2.51 35.99,2.51 37.21,3.73 37.21,7.09 37.21,8.66
A  (via drill 0.35)
  Top 0.152: v58.42,19.37 60.33,17.46 60.33,12.06 IC2.4 | R25.2 50.16,32.07 50.27,31.97 50.27,25.79 51.12,24.94 51.12,23.81 52.07,22.86 54.41,22.86 55.56,21.7 v55.56,20.95
  Bottom 0.152: v55.56,20.95 57.15,19.37 v58.42,19.37
AC1
  Top 0.152: B1.AC1 10.07,17.63 6.48,14.04 6.36,13.91
  Top 0.203: R6.1 40.03,10.06 38.35,8.38 38.35,3.1 37.08,1.83 7.01,1.83 5.26,3.58 5.26,12.81 6.48,14.04
  Bottom 1.016: F9.2 13.44,26.85 13.44,22.43 11.04,20.03 B1.AC1
AC2
  Top 0.152: B1.AC2 11.04,23.62 9.44,22.02 9.44,18.43 5.33,14.33
  Top 0.203: R7.1 40.51,8.05 39.47,7.01 39.47,1.52 38.81,0.86 3.86,0.86 1.27,3.45 1.27,10.26 5.33,14.33
  Top 1.27: J1.2 7.21,26.93 9.32,24.81 B1.AC2
B  (via drill 0.35)
  Top 0.152: v60.96,16.83 61.59,16.19 61.59,12.06 IC2.5 | R26.2 39.69,32.38 39.19,32.38 38.73,31.93 v38.73,31.75
  Bottom 0.152: v38.73,31.75 38.73,19.41 41,17.14 60.64,17.14 v60.96,16.83
C  (via drill 0.28, 0.35)
  Top 0.152: v61.28,17.78 62.87,16.19 62.87,12.06 IC2.6 | R27.2 45.78,23.71 46.35,23.14 v46.35,20.32
  Bottom 0.152: v46.35,20.32 48.62,18.06 61,18.06 v61.28,17.78
CRUCE_POR_CERO  (via drill 0.35)
  Top 0.152: v55.24,6.99 52.7,6.99 IC4.8 | v69.56,8.89 70.69,10.02 IC2.12
  Bottom 0.152: v55.24,6.99 57.15,8.89 v69.56,8.89
D  (via drill 0.28, 0.35)
  Top 0.152: v51.44,20.32 51.44,22.23 50.16,23.5 R28.2 | v61.28,18.73 62.22,18.73 64.14,16.82 64.14,12.06 IC2.7
  Bottom 0.152: v51.44,20.32 53.02,18.73 v61.28,18.73
DISPLAY1
  Top 0.152: R33.2 52.7,26.99 52.83,26.99 53.61,27.77 62.66,27.77 63.18,28.3 63.18,30.48 65.04,32.33 69.53,32.33 70.8,31.06 70.8,27.38 70.18,26.76 70.18,25.74 70.8,25.12 70.8,21.59 IC2.17
DISPLAY2  (via drill 0.35)
  Top 0.152: v47.62,26.35 45.4,26.35 R34.2 | v68.9,24.45 69.42,23.93 IC2.18
  Bottom 0.152: v47.62,26.35 48.52,25.46 56.29,25.46 57.3,24.45 v68.9,24.45
DISPLAY3  (via drill 0.35)
  Top 0.152: v41.35,26.99 41.35,28.11 39.46,30 R35.2 | v61.91,19.68 62.87,20.64 62.87,21.27 IC2.23
  Bottom 0.152: v41.35,26.99 46.43,21.91 59.69,21.91 v61.91,19.68
DISPLAY4  (via drill 0.35)
  Top 0.152: v41.27,21.91 40.32,21.91 R36.2 | v60.64,19.68 61.59,20.64 61.59,21.27 IC2.24
  Bottom 0.152: v41.27,21.91 41.59,21.59 58.74,21.59 v60.64,19.68
E  (via drill 0.35)
  Top 0.152: v55.08,23.29 54.98,23.39 52.72,23.39 R29.2 | v68.26,19.05 68.26,15.82 69.42,14.67 IC2.11
  Bottom 0.152: v55.08,23.29 55.83,22.54 64.77,22.54 v68.26,19.05
F  (via drill 0.35)
  Top 0.152: v48.26,24.77 48.26,31.43 47.62,32.07 R30.2 | v68.9,17.46 73.03,13.34 73.03,12.06 IC2.14
  Bottom 0.152: v48.26,24.77 50.8,22.23 64.14,22.23 v68.9,17.46
FILTRADA  (via drill 0.35)
  Top 0.203: IC4.13 54.53,10.16 54.67,10.31 | 54.67,10.31 R14.2 56.05,10.32 56.19,10.19 v56.21,10.21 | IC4.14 52.75,10.74 53.8,10.74 | 53.8,10.74 54.23,10.74 54.67,10.31 | C9.1 54.28,14.73 53.8,14.25 53.8,10.74 | v58.83,10.21 59.26,10.64 IC2.3
  Bottom 0.203: v56.21,10.21 v58.83,10.21
G
  Top 0.152: 42.23,23.5 | 42.23,23.5 42.34,23.58 R31.2 | IC2.15 73.34,21.59 73.98,22.23 73.98,33.06 70.21,36.83 39.69,36.83 37.78,34.92 37.78,29.84 38.73,28.89 38.73,23.44 39.32,22.86 41.59,22.86 42.23,23.5
GND  (via drill 0.28, 0.3, 0.33, 0.35, 0.4)
  Top 0.152: 24.13,35.24 R1.2 | 63.37,26.54 64.45,27.62 64.45,29.64 64.45,29.84 SV1.3 | 66.67,27.3 C12.2 66.99,26.99 68.26,25.72 68.26,21.59 68.18,21.44 IC2.19 67.94,21.27 67.94,20.64 | 65.72,12.06 IC2.8 | R11.2 47.94,5.08 47.94,3.49 C5.2 48.02,3.5 48.34,3.52 49.86,3.52 50.24,3.9 50.24,7.38 51.44,8.57 v51.44,8.88 v51.44,8.89 48.9,11.43 48.9,13.34 | C23.2 41.91,17.46 43.81,15.56 43.81,14.61 IC5.2 44.13,14.29 45.09,13.34 45.61,13.34 46.04,13.77 46.04,17.46 | 47.94,17.46 46.04,17.46 | 46.04,17.46 45.4,17.46 C21.2 | 47.94,17.46 47.94,16.83 C8.2 47.94,16.51 47.94,14.61 48.9,13.65 48.9,13.34 | 47.94,17.46 49.53,19.05 54.93,19.05 C16.2 55.24,19.37 56.84,19.37 57.99,20.51 IC2.27 58.1,21.59 58.1,23.5 C13.2 58.1,23.81 58.1,26.29 58.74,26.93 61.02,26.93 62.23,25.72 C17.2 | 48.9,13.34 50.16,14.61 50.8,14.61 C20.- | 67.51,13.73 67.51,10.75 67.51,10.74 | 66.26,13.12 66.26,10.79 66.25,10.79 | 68.84,13.21 68.8,13.17 68.8,10.83
  Top 0.203: v51.44,8.88 51.45,8.87 IC4.11
  Top 0.254: C4.- 21.54,8.81
  Top 0.406: 81.64,25.65 81.64,16
  Top 0.508: LED1.C 8.36,13.61 6.35,11.61 6.35,4.88 8.03,3.2 v8.03,3.02
  Top 0.61: IC2.8 65.61,17.02 66.37,17.78 66.37,18.64 68.18,20.45 68.18,21.44 | C12.2 64.47,29.64 64.45,29.64
  Top 0.813: VRMS/FREC..4 VRMS/FREC..3 80.84,15.2 81.64,16 | T1.3 81.64,25.65
  Top 1.016: D2.A 22.38,11.01 | 22.38,11.01 21.54,10.16 21.54,8.81 | C1.2 18.85,19.05 22.38,15.51 22.38,11.01 | SV1.3 64.57,27.74 63.37,26.54 63.16,26.54 C17.2 | C1.2 18.85,22.02 22.25,25.43 25.6,25.43 27.23,27.05 27.23,31.2 26.45,31.98 26.45,34.41 25.3,35.56 R1.2 | JP2.1 19.74,18.65 C1.2
  Bottom 0.152: 29.84,4.13 IC6.1 | 21.55,7.81 C4.- 21.27,7.62 | 27.87,10.26 C24.2 | 3.53,5.54 C19.- | 66.99,16.19 C14.2 66.72,16.27 66.67,16.19 | 57.78,16.19 C10.2 58.01,16.32 58.1,16.19 | 51.12,14.92 C20.- | 72.07,16.51 C11.2 71.88,16.27 68.4,16.27 C15.2 | 37.15,15.88 C22.-
  Bottom 0.203: 51.24,9.2 51.24,8.88
  Bottom 0.813: C19.- 6.11,3.02 v8.03,3.02 18.19,3.02 21.54,6.38 C4.- 23.32,7.85 23.76,7.4 | IC6.1 27.35,3.82 23.76,7.4 | D2.A 24.13,12.7 | 24.13,12.7 24.13,7.77 23.76,7.4 | C24.2 25.31,12.7 24.13,12.7 | 27.87,10.26 27.87,14.05 29.9,16.08 C22.- 36.98,15.82 38.23,14.58 40.69,14.58 41.83,15.72 43.23,15.72 43.97,14.99 IC5.2 | v51.44,8.88 51.82,8.88 53.65,7.06 IC3.3 | C20.- 54.48,14.88 55.92,16.32 58.01,16.32 | C10.2 59.35,16.34 60.2,15.49 62.84,15.49 63.62,16.27 66.72,16.27 | C14.2 68.28,16.29 C15.2 | 69.44,16.27 72.4,16.27 72.47,16.2 72.99,16.2 75.5,13.69 79.2,13.69 VRMS/FREC..3 | C6.2 51.44,9 v51.44,8.88 | C7.2 51.24,8.88 v51.44,8.88
  Bottom 1.016: 69.44,16.27 68.4,16.27 | B1.- 7.76,20.91 7.76,16.79 3.28,12.3 C19.-
  other vias: 69.95,34.44 48.82,34.62 51.16,31.17 56.24,29.01 51.69,34.32 46.56,18.62 49.28,19.02 54.31,20.65 70.33,14.68 59.51,19.61 48.87,22.91 46.35,27.13 46.99,25.35 46.13,29.34 47.37,30.96 43.76,34.11 39.67,28.63 42.49,24.79 40.64,9.04 63.47,14.58 60.91,14.63 62.26,14.61 50.06,24.87 53.9,24 51.71,24.49 41.3,24.03 40.06,25.81 71.07,26.19
  pour Top (isolate 0.254): 82.55,37.97 37.64,37.97 37.64,0 82.55,0
  pour Bottom (isolate 0.254): 82.55,37.97 33.81,37.97 33.81,0.23 33.81,0 82.55,0
INT1
  Top 0.152: R23.1 59.05,25.72 60.33,25.72 C17.1 60.64,25.4 60.64,24.13 R22.2 60.64,23.81 60.64,21.59 IC2.25
MCLR  (via drill 0.35)
  Top 0.152: v57.15,9.53 56.97,9.7 56.97,11.61 56.83,11.75 IC2.1 | v74.51,12.41 74.51,21.53 74.74,21.75 74.74,25.09 v75.13,25.09
  Top 0.203: IC2.1 56.48,11.8 R20.1
  Bottom 0.152: SV1.1 69.85,29.84 74.04,29.84 75.13,28.75 v75.13,25.09 | v74.51,12.41 74.59,12.48 74.59,10.19 73.93,9.53 v57.15,9.53
N$1
  Top 1.016: R4.1 32.21,32.1 IC1.1 32.21,26.36 33.69,24.88 C2.1
N$2
  Top 1.016: 31.43,16.1 31.43,16.9 32.21,17.68 IC1.8 32.21,21.54 33.8,23.13 C2.2 36.13,23.13 36.93,23.93 36.93,25.6 35.79,26.75 C3.- 33.81,34.52 33.81,35.13 32.56,36.37 28.32,36.37 27.81,35.87 R2.1 | 31.43,16.1 L1.1 L1.2 | IC1.7 29.84,17.69 30.92,16.62 | 30.92,16.62 31.43,16.1 | IC1.6 27.3,18.29 28.98,16.62 | 28.98,16.62 30.92,16.62 | 28.98,16.62 26.82,16.62 24.94,18.49 IC1.5 24.38,19.4 D1.C
  pour Top (isolate 0.254): 22.73,14.78 22.73,24 35.2,24 36.07,24 36.07,15.52 36.07,9.68 33.15,9.68 25.5,9.68 25.5,13.44 25.5,13.77 23.19,13.77 22.73,13.77
N$3
  Top 1.016: IC1.2 29.84,32.68 R3.1 R2.2
N$4  (via drill 0.4)
  Top 0.152: 29.67,34.36 R3.2 | C3.+ | 37.47,27.94 D3.C
  Top 0.254: 30.61,34.42 30.63,34.42 v30.68,34.47 30.8,34.35 R4.2
  Top 0.508: D3.C 37.16,28.27 37.16,33.7 C3.+ | R3.2 30.59,34.43 30.61,34.42
  Bottom 0.813: C3.+ 31.29,35.08 v30.68,34.47
N$5
  Top 1.016: D2.C 16.51,14.96 D1.A
N$6
  Top 0.203: R15.1 51.07,12.78 R16.2 51.12,13.07 52.53,14.48 C9.2 51.68,15.62 50.58,16.71 C8.1
N$7
  Bottom 0.813: D4.A 13.26,6.66 14.27,7.66 JP1.2
N$8
  Top 0.203: R18.1 48.86,2.62 R17.2
N$9
  Top 0.203: R19.1 53.16,17.41 C16.1 55.27,17.16 55.27,14.96 54.76,14.45 R20.2
N$10
  Top 0.152: R21.2 77.15,30.65 77.15,27.52 T1.1
  Bottom 0.152: 77.27,23.5 LS1.2
  Bottom 0.406: T1.1 77.27,23.5
N$11
  Top 0.152: R24.2 74.79,26.75 75.67,26.75 76.83,25.58 T1.2
N$12
  Top 0.406: R5.1 15.53,8.1 15.53,11.84 14.5,12.87 LED1.A
N$13  (via drill 0.35)
  Top 0.152: v63.82,23.81 62.55,23.81 R22.1 | 76.2,8.72 VRMS/FREC..2 | VRMS/FREC..1
  Top 0.254: VRMS/FREC..2 76.21,15.19 VRMS/FREC..1
  Top 0.406: 76.2,8.71 VRMS/FREC..2
  Bottom 0.152: v63.82,23.81 72.71,23.81 73.77,22.75 73.77,19.11 76.13,16.75 76.13,15.28 VRMS/FREC..1
N$14  (via drill 0.6)
  Top 0.813: D4.C 20.22,6.66 20.78,6.1 24.03,6.1 24.28,6.35 24.31,6.35 v26.34,8.38
  Bottom 0.406: 27.88,8.38 C24.1
  Bottom 0.813: C24.1 27.77,8.36 26.36,8.36 v26.34,8.38
  Bottom 1.016: IC6.3 27.88,8.38
N$15
  Top 0.152: R25.1 50.16,33.97 50.16,35.56 DISPLAY.11
N$17
  Top 0.152: Q1.1 54.29,33.34 52.7,34.92 52.7,35.56 DISPLAY.12
N$18
  Top 0.152: R26.1 40.01,34.29 40.01,35.56 DISPLAY.7
N$19
  Top 0.152: R27.1 45.09,20.64 DISPLAY.4
N$20
  Top 0.152: R28.1 50.16,20.64 DISPLAY.2
N$21
  Top 0.152: R29.1 52.7,21.91 52.7,20.64 DISPLAY.1
N$22
  Top 0.152: R30.1 47.62,33.97 47.62,35.56 DISPLAY.10
N$23
  Top 0.152: R31.1 42.55,21.91 42.55,20.64 DISPLAY.5
N$24
  Top 0.152: R32.1 47.62,21.91 47.62,20.64 DISPLAY.3
N$25
  Top 0.152: R33.1 52.7,28.57 52.7,31.75 Q1.2
N$26
  Bottom 0.152: Q2.1 48.9,29.53 48.9,31.75 45.09,35.56 DISPLAY.9
N$27
  Top 0.152: Q3.1 42.55,33.02 42.55,35.56 DISPLAY.8
N$28
  Bottom 0.152: Q4.1 40.04,27.09 39.37,26.42 39.37,21.06 DISPLAY.6
N$29
  Top 0.152: R34.1 45.4,28.26 46.99,28.26 Q2.2
N$30
  Top 0.152: R35.1 41.45,30.48 43.5,30.48 43.5,30.8 Q3.2
N$31
  Top 0.152: R36.1 40.18,24.92 40.56,25.3 Q4.2
N$41
  Top 1.27: J1.1 2.79,31.44 F9.1
OSC1  (via drill 0.35)
  Top 0.203: Y1.1 65.23,6.58 arc90 66.88,8.23 IC2.9 v66.88,13.51
  Bottom 0.203: v66.88,13.51 66.88,14.39 C14.1
OSC2  (via drill 0.35)
  Top 0.203: Y1.2 69.75,6.58 arc-90 68.15,8.18 IC2.10 68.15,13.46 v68.17,13.49
  Bottom 0.203: v68.17,13.49 68.17,14.39 C15.1
PD
  Top 0.152: R32.2 47.31,23.81 46.29,24.83 45.02,24.83 44.13,25.72 44.13,29.84 45.84,31.55 45.84,31.87 46.99,33.02 53.34,33.02 54.29,32.07 58,32.07 59.26,33.33 69.72,33.33 71.75,31.29 71.75,21.59 IC2.16
PGEC2  (via drill 0.35)
  Top 0.152: v64.45,25.08 64.45,21.59 IC2.22
  Bottom 0.152: v64.45,25.08 59.69,29.84 SV1.5
PGED2  (via drill 0.35)
  Top 0.152: v65.41,26.67 65.41,21.59 IC2.21
  Bottom 0.152: v65.41,26.67 62.23,29.84 SV1.4
PWM  (via drill 0.35)
  Top 0.152: v59.37,23.18 59.37,21.59 IC2.26 | R24.1 73.09,26.5 73.48,26.11 73.48,23.77 72.89,23.18 v72.39,23.18
  Bottom 0.152: v59.37,23.18 v72.39,23.18
VCAP
  Top 0.203: IC2.20 66.88,24.43 C12.1
VINA+
  Top 0.203: IC4.3 46.12,9.52 45.8,9.2 45.8,9.18 45.2,8.57 C18.2 44.55,8.04 43.69,8.04 R7.2 43.67,6.86 R9.2
VINA-
  Top 0.203: IC4.2 45.24,10.16 C18.1 44.91,10.15 43.79,10.15 R6.2 43.19,10.56 R8.1
VINB+
  Top 0.203: 49,6.55 48.54,6.1 46.69,6.1 46.16,5.58 R11.1 46.24,5.05 C5.1 | IC4.5 48.4,8.21 49,7.62 49,6.55 | R10.1 49.39,6.16 49,6.55
VINB-  (via drill 0.35)
  Top 0.203: R12.1 42,6.53 v43.01,6.53 | v45.31,7.52 46.75,7.52 IC4.6
  Bottom 0.203: v43.01,6.53 44,7.52 45.36,7.52 | 45.36,7.52 | 45.36,7.52 v45.31,7.52
VINC+
  Top 0.203: R14.1 54.28,8.21 IC4.10
VINC-  (via drill 0.35)
  Top 0.203: IC4.9 51.74,7.57 v51.4,7.24
  Bottom 0.203: v51.4,7.24 v51.39,7.24 R13.1
VIND+
  Top 0.203: IC4.12 52.65,9.49 51.9,9.49 51.61,9.78 51.61,11.61 52.73,12.72 R16.1
VOUTA
  Top 0.203: IC4.1 45.55,12.06 45.41,12.06 | 45.41,12.06 R8.2 | R15.2 46.13,12.78 45.41,12.06
VREF_1_5V  (via drill 0.35)
  Top 0.203: R12.2 44.07,4.76 R9.1 44.09,4.89 45.06,5.86 45.06,5.87 46.11,6.92 IC4.7 47.82,6.92 47.85,6.88 47.93,6.88 v47.95,6.91
  Bottom 0.203: v47.95,6.91 48.5,6.91 R13.2